# Altium schematic sheet PIC_CONTROLLER.SchDoc
size A3; ApprovedBy: D. Grossman; CheckedBy: G. Engel; Author: Y. Yakov; CompanyName: LightSense; DrawnBy: Y. Yakov; Engineer: Y.Yakov; Organization: LightSense
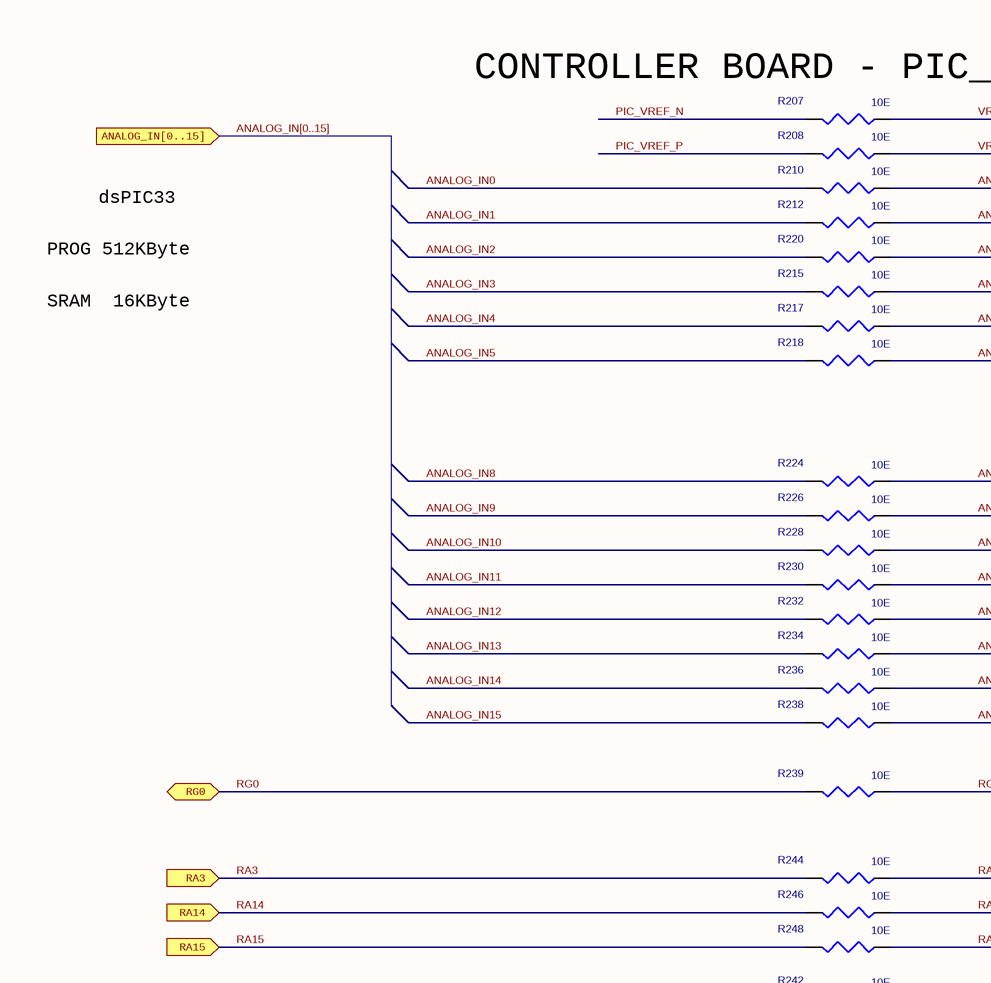
[diagram p0: PIC_CONTROLLER.SchDoc, top left]
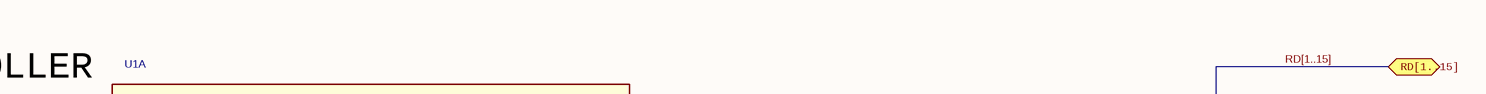
[diagram p1: PIC_CONTROLLER.SchDoc, top right]
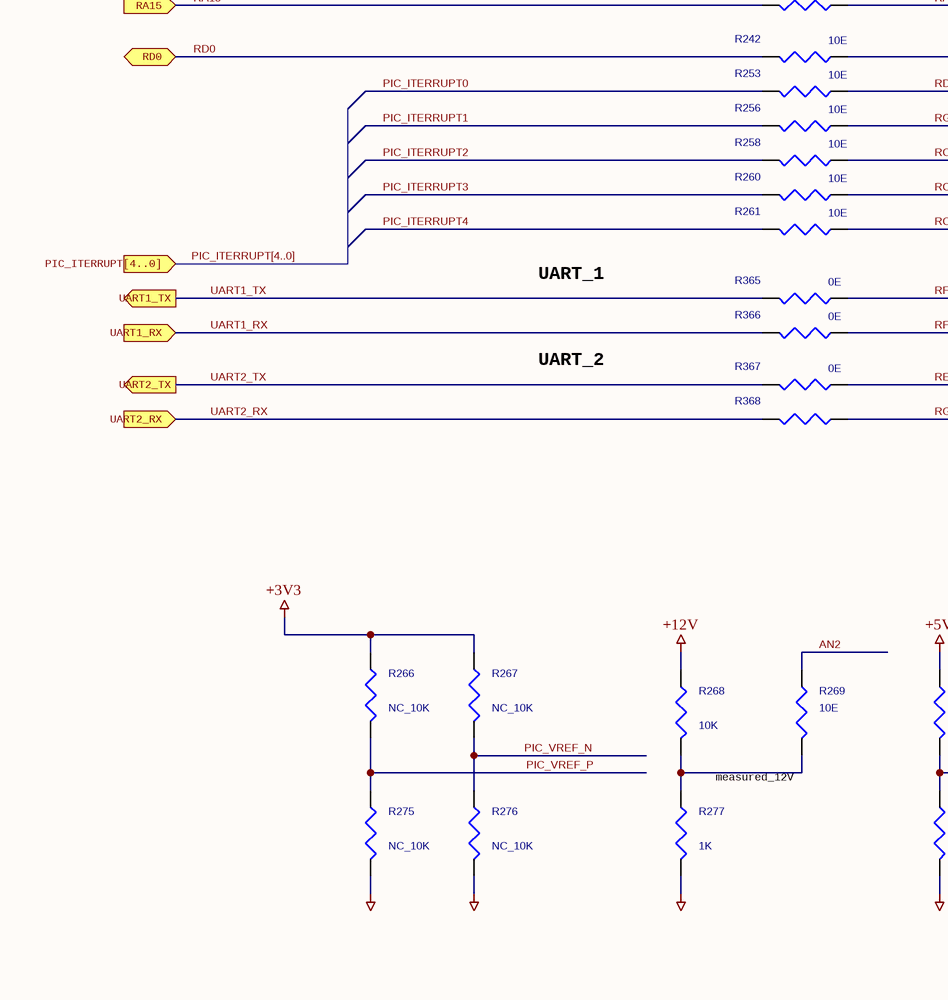
[diagram p2: PIC_CONTROLLER.SchDoc, bottom left]
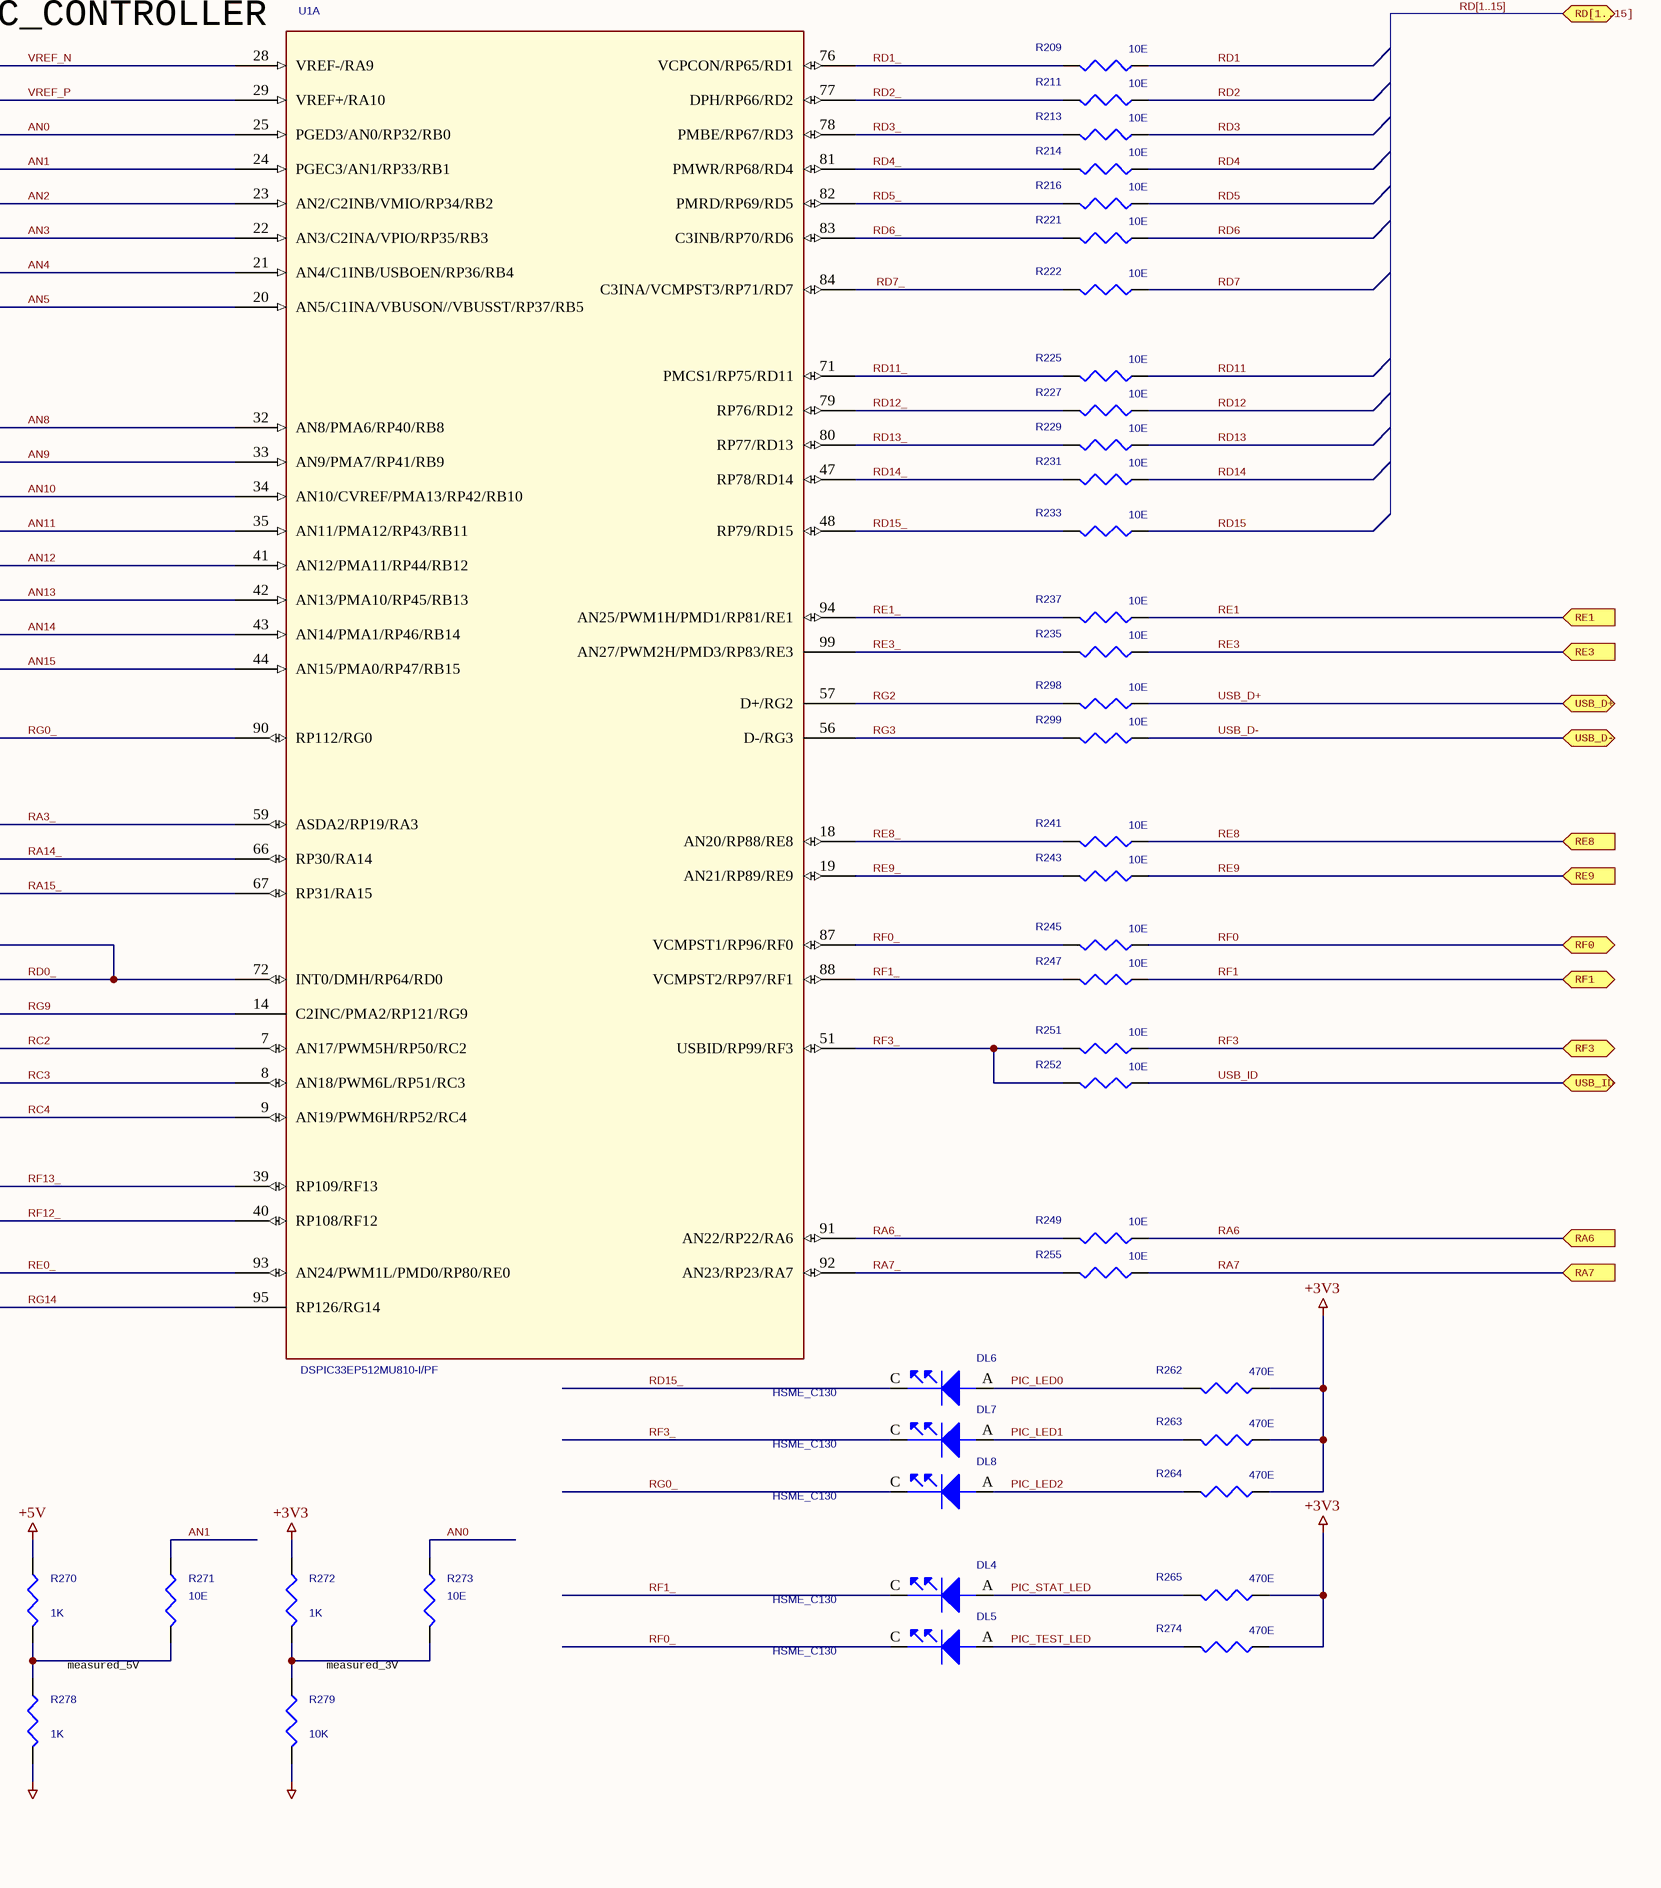
[diagram p3: PIC_CONTROLLER.SchDoc, bottom right]

## Parts
DL4  HSME_C130  [LED_0603]
DL5  HSME_C130  [LED_0603]
DL6  HSME_C130  [LED_0603]
DL7  HSME_C130  [LED_0603]
DL8  HSME_C130  [LED_0603]
R207  10E  [0603]
R208  10E  [0603]
R209  10E  [0603]
R210  10E  [0603]
R211  10E  [0603]
R212  10E  [0603]
R213  10E  [0603]
R214  10E  [0603]
R215  10E  [0603]
R216  10E  [0603]
R217  10E  [0603]
R218  10E  [0603]
R220  10E  [0603]
R221  10E  [0603]
R222  10E  [0603]
R224  10E  [0603]
R225  10E  [0603]
R226  10E  [0603]
R227  10E  [0603]
R228  10E  [0603]
R229  10E  [0603]
R230  10E  [0603]
R231  10E  [0603]
R232  10E  [0603]
R233  10E  [0603]
R234  10E  [0603]
R235  10E  [0603]
R236  10E  [0603]
R237  10E  [0603]
R238  10E  [0603]
R239  10E  [0603]
R241  10E  [0603]
R242  10E  [0603]
R243  10E  [0603]
R244  10E  [0603]
R245  10E  [0603]
R246  10E  [0603]
R247  10E  [0603]
R248  10E  [0603]
R249  10E  [0603]
R251  10E  [0603]
R252  10E  [0603]
R253  10E  [0603]
R255  10E  [0603]
R256  10E  [0603]
R258  10E  [0603]
R260  10E  [0603]
R261  10E  [0603]
R262  470E  [0603]
R263  470E  [0603]
R264  470E  [0603]
R265  470E  [0603]
R266  NC_10K  [0603]
R267  NC_10K  [0603]
R268  10K  [0603]
R269  10E  [0603]
R270  1K  [0603]
R271  10E  [0603]
R272  1K  [0603]
R273  10E  [0603]
R274  470E  [0603]
R275  NC_10K  [0603]
R276  NC_10K  [0603]
R277  1K  [0603]
R278  1K  [0603]
R279  10K  [0603]
R298  10E  [0603]
R299  10E  [0603]
R365  0E  [0603]
R366  0E  [0603]
R367  0E  [0603]
R368  0E  [0603]  (value not drawn)
U1  DSPIC33EP512MU810-I/PF  [TQFP_100]  (part A of 2)

## Ports
ANALOG_IN[0..15] (in), PIC_ITERRUPT[4..0] (in), RA3 (in), RA6 (in), RA7 (in), RA14 (in), RA15 (in), RD0 (bidir), RD[1..15] (bidir), RE1 (in), RE3 (in), RE8 (in), RE9 (in), RF0 (bidir), RF1 (bidir), RF3 (bidir), RG0 (bidir), UART1_RX (in), UART1_TX (out), UART2_RX (in), UART2_TX (out), USB_D+ (bidir), USB_D- (bidir), USB_ID (bidir)

## Nets
+3V3: R262.1 R263.1 R264.1 R265.1 R266.1 R267.1 R272.1 R274.1
+5V: R270.1
+12V: R268.1
GND_CPU: R275.2 R276.2 R277.2 R278.2 R279.2
AN0: R210.1 R273.1 U1.25(PGED3/AN0/RP32/RB0)
AN1: R212.1 R271.1 U1.24(PGEC3/AN1/RP33/RB1)
AN2: R220.1 R269.1 U1.23(AN2/C2INB/VMIO/RP34/RB2)
AN3: R215.1 U1.22(AN3/C2INA/VPIO/RP35/RB3)
AN4: R217.1 U1.21(AN4/C1INB/USBOEN/RP36/RB4)
AN5: R218.1 U1.20(AN5/C1INA/VBUSON//VBUSST/RP37/RB5)
AN8: R224.1 U1.32(AN8/PMA6/RP40/RB8)
AN9: R226.1 U1.33(AN9/PMA7/RP41/RB9)
AN10: R228.1 U1.34(AN10/CVREF/PMA13/RP42/RB10)
AN11: R230.1 U1.35(AN11/PMA12/RP43/RB11)
AN12: R232.1 U1.41(AN12/PMA11/RP44/RB12)
AN13: R234.1 U1.42(AN13/PMA10/RP45/RB13)
AN14: R236.1 U1.43(AN14/PMA1/RP46/RB14)
AN15: R238.1 U1.44(AN15/PMA0/RP47/RB15)
ANALOG_IN0: R210.2
ANALOG_IN1: R212.2
ANALOG_IN2: R220.2
ANALOG_IN3: R215.2
ANALOG_IN4: R217.2
ANALOG_IN5: R218.2
ANALOG_IN8: R224.2
ANALOG_IN9: R226.2
ANALOG_IN10: R228.2
ANALOG_IN11: R230.2
ANALOG_IN12: R232.2
ANALOG_IN13: R234.2
ANALOG_IN14: R236.2
ANALOG_IN15: R238.2
PIC_ITERRUPT0: R253.2
PIC_ITERRUPT1: R256.2
PIC_ITERRUPT2: R258.2
PIC_ITERRUPT3: R260.2
PIC_ITERRUPT4: R261.2
PIC_LED0: DL6.A(ANODE) R262.2
PIC_LED1: DL7.A(ANODE) R263.2
PIC_LED2: DL8.A(ANODE) R264.2
PIC_STAT_LED: DL4.A(ANODE) R265.2
PIC_TEST_LED: DL5.A(ANODE) R274.2
PIC_VREF_N: R207.2 R267.2 R276.1
PIC_VREF_P: R208.2 R266.2 R275.1
RA3: R244.2 ; port RA3
RA3_: R244.1 U1.59(ASDA2/RP19/RA3)
RA6: R249.1 ; port RA6
RA6_: R249.2 U1.91(AN22/RP22/RA6)
RA7: R255.1 ; port RA7
RA7_: R255.2 U1.92(AN23/RP23/RA7)
RA14: R246.2 ; port RA14
RA14_: R246.1 U1.66(RP30/RA14)
RA15: R248.2 ; port RA15
RA15_: R248.1 U1.67(RP31/RA15)
RC2: R258.1 U1.7(AN17/PWM5H/RP50/RC2)
RC3: R260.1 U1.8(AN18/PWM6L/RP51/RC3)
RC4: R261.1 U1.9(AN19/PWM6H/RP52/RC4)
RD0: R242.2 ; port RD0
RD0_: R242.1 R253.1 U1.72(INT0/DMH/RP64/RD0)
RD1: R209.1
RD1_: R209.2 U1.76(VCPCON/RP65/RD1)
RD2: R211.1
RD2_: R211.2 U1.77(DPH/RP66/RD2)
RD3: R213.1
RD3_: R213.2 U1.78(PMBE/RP67/RD3)
RD4: R214.1
RD4_: R214.2 U1.81(PMWR/RP68/RD4)
RD5: R216.1
RD5_: R216.2 U1.82(PMRD/RP69/RD5)
RD6: R221.1
RD6_: R221.2 U1.83(C3INB/RP70/RD6)
RD7: R222.1
RD7_: R222.2 U1.84(C3INA/VCMPST3/RP71/RD7)
RD11: R225.1
RD11_: R225.2 U1.71(PMCS1/RP75/RD11)
RD12: R227.1
RD12_: R227.2 U1.79(RP76/RD12)
RD13: R229.1
RD13_: R229.2 U1.80(RP77/RD13)
RD14: R231.1
RD14_: R231.2 U1.47(RP78/RD14)
RD15: R233.1
RD15_: DL6.C(CATHODE) R233.2 U1.48(RP79/RD15)
RE0_: R367.1 U1.93(AN24/PWM1L/PMD0/RP80/RE0)
RE1: R237.1 ; port RE1
RE1_: R237.2 U1.94(AN25/PWM1H/PMD1/RP81/RE1)
RE3: R235.1 ; port RE3
RE3_: R235.2 U1.99(AN27/PWM2H/PMD3/RP83/RE3)
RE8: R241.1 ; port RE8
RE8_: R241.2 U1.18(AN20/RP88/RE8)
RE9: R243.1 ; port RE9
RE9_: R243.2 U1.19(AN21/RP89/RE9)
RF0: R245.1 ; port RF0
RF0_: DL5.C(CATHODE) R245.2 U1.87(VCMPST1/RP96/RF0)
RF1: R247.1 ; port RF1
RF1_: DL4.C(CATHODE) R247.2 U1.88(VCMPST2/RP97/RF1)
RF3: R251.1 ; port RF3
RF3_: DL7.C(CATHODE) R251.2 R252.2 U1.51(USBID/RP99/RF3)
RF12_: R366.1 U1.40(RP108/RF12)
RF13_: R365.1 U1.39(RP109/RF13)
RG0: R239.2 ; port RG0
RG0_: DL8.C(CATHODE) R239.1 U1.90(RP112/RG0)
RG2: R298.2 U1.57(D+/RG2)
RG3: R299.2 U1.56(D-/RG3)
RG9: R256.1 U1.14(C2INC/PMA2/RP121/RG9)
RG14: R368.1 U1.95(RP126/RG14)
UART1_RX: R366.2 ; port UART1_RX
UART1_TX: R365.2 ; port UART1_TX
UART2_RX: R368.2 ; port UART2_RX
UART2_TX: R367.2 ; port UART2_TX
USB_D+: R298.1 ; port USB_D+
USB_D-: R299.1 ; port USB_D-
USB_ID: R252.1 ; port USB_ID
VREF_N: R207.1 U1.28(VREF-/RA9)
VREF_P: R208.1 U1.29(VREF+/RA10)
NetR268_2: R268.2 R269.2 R277.1
NetR270_2: R270.2 R271.2 R278.1
NetR272_2: R272.2 R273.2 R279.1

## Buses and harness runs
bus ANALOG_IN[0..15] = port ANALOG_IN[0..15]
bus PIC_ITERRUPT[4..0] = port PIC_ITERRUPT[4..0]
bus RD[1..15] = port RD[1..15]

## Notes on the sheet
- (near R207) CONTROLLER BOARD - PIC_CONTROLLER
- dsPIC33
- PROG 512KByte
- SRAM  16KByte
- UART_1
- UART_2
- measured_12V
- measured_5V
- measured_3V
- Name
- Signature
- Date
- File:
- Board Name:
- Description:
- Document Version:
- Sheet
- of
- Approved
- Reviewed
- Designed
- This drawing and any accompanying documents contain confidential information intended for a specific individual and purpose.
  This information, owned by Lightsense, is private and confidential. If you are not the intended recipient, you are hereby notified that any disclosure, copying or distribution, or the taking of any action based on the contents of this information, is strictly prohibited.

## Library data of the parts
DL4 DL5 = LED: Lumenis_P/N: EL0000123; MFG: AVAGO; MFG_PN: HSME_C130
DL6-DL8 = LED: MFG: AVAGO; Lumenis_P/N: EL0000123; MFG_PN: HSME_C130
R207-R209 R211 R213 R214 R216 R221 R222 R224-R228 R230 R232-R234 R236-R238 R241 R243 R244 R246 R248 R251 R253 R255 R269 R366 = R_Dup1: MFG_PN: RC0603FR-0710R0L; MFG: YAGEO
R210 R212 R215 R217 R218 R220 R229 R231 R235 R239 R242 R245 R247 R249 R252 R256 R258 R260 R261 R271 R273 R298 R299 R365 R367 R368 = R_Dup1: MFG: YAGEO; MFG_PN: RC0603FR-0710R0L
R262 R265 = R_Dup1: MFG: YAGEO; MFG_PN: RC0603FR-07470RL
R263 R264 R274 = R_Dup1: MFG_PN: RC0603FR-07470RL; MFG: YAGEO
R266 R268 R275 R279 = R_Dup1: MFG: YAGEO; MFG_PN: RC0603FR-0710K0L
R267 R276 = R_Dup1: MFG_PN: RC0603FR-0710K0L; MFG: YAGEO
R270 R278 = R_Dup1: MFG_PN: RC0603FR-071K00L; MFG: YAGEO
R272 R277 = R_Dup1: MFG: YAGEO; MFG_PN: RC0603FR-071K00L
U1 = DSPIC33EP512MU810-I/PF_0: MFG: MICROCHIP; MFG_PN: DSPIC33EP512MU810-I/PF